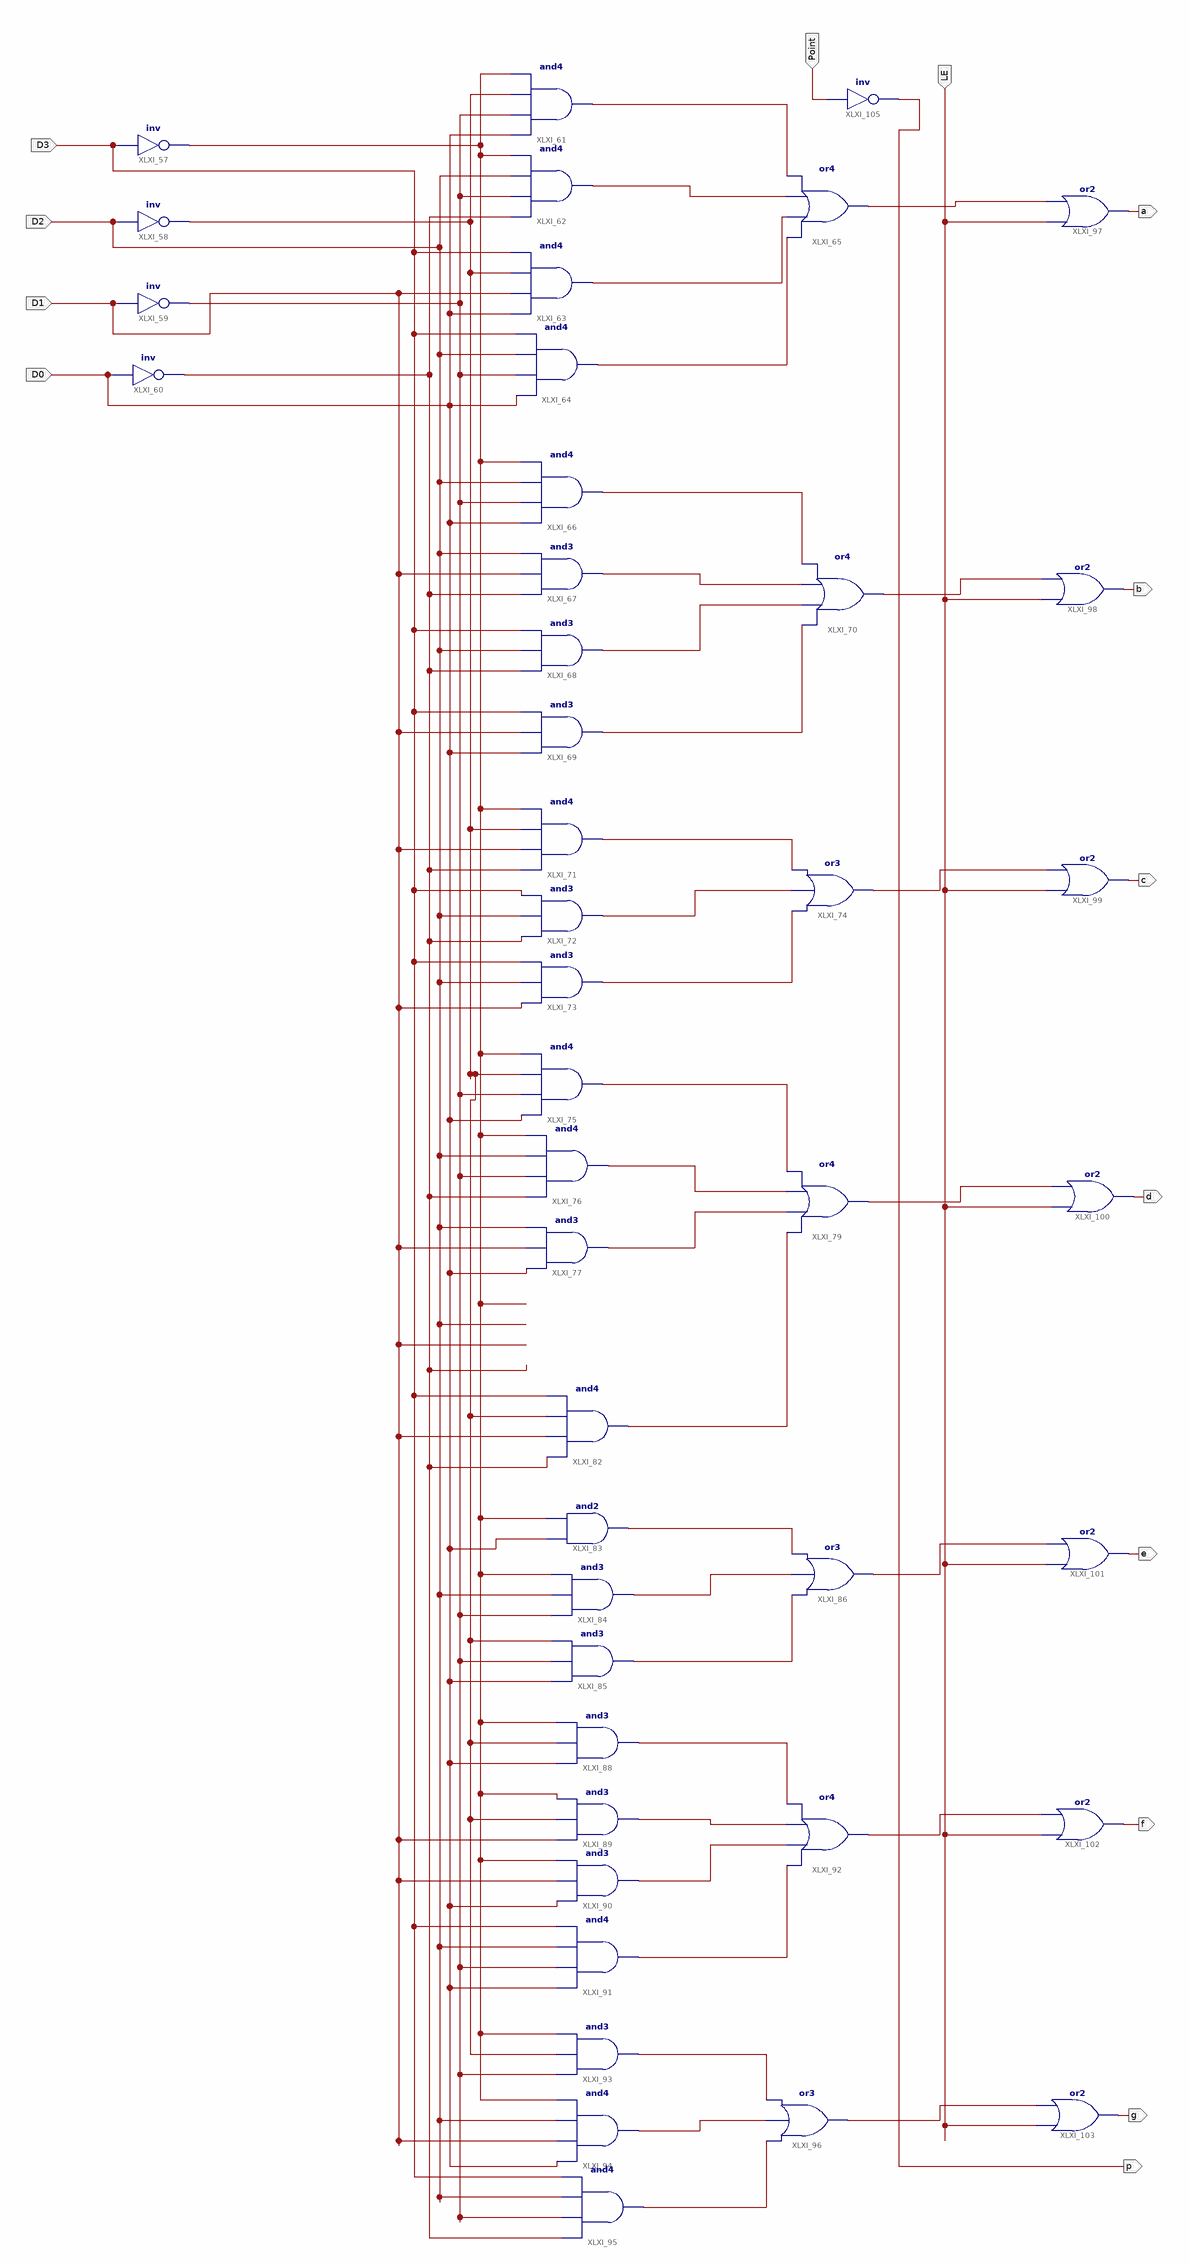
[diagram p0: schematic sheet 1]
// Xilinx ISE schematic MC14495.sch (kintex7) as structural Verilog: 44 symbols, 14 ports
module MC14495 (
  input  D2,
  input  D3,
  input  D1,
  input  D0,
  input  LE,
  input  Point,
  output a,
  output b,
  output c,
  output d,
  output e,
  output f,
  output g,
  output p
);

  wire XLXN_48, XLXN_50, XLXN_58, XLXN_59, XLXN_60, XLXN_61, XLXN_95, XLXN_96, XLXN_97, XLXN_98, XLXN_104,
       XLXN_105, XLXN_106, XLXN_112, XLXN_113, XLXN_114, XLXN_117, XLXN_118, XLXN_119, XLXN_121, XLXN_122,
       XLXN_123, XLXN_125, XLXN_126, XLXN_127, XLXN_128, XLXN_130, XLXN_132, XLXN_133, XLXN_136, XLXN_137,
       XLXN_138, XLXN_139, XLXN_140, XLXN_141, XLXN_142;

  not XLXI_57 (XLXN_123, D3);
  not XLXI_58 (XLXN_48, D2);
  not XLXI_59 (XLXN_50, D1);
  not XLXI_60 (XLXN_117, D0);
  and XLXI_61 (XLXN_58, D0, XLXN_50, XLXN_48, XLXN_123);
  and XLXI_62 (XLXN_59, XLXN_117, XLXN_50, D2, XLXN_123);
  and XLXI_63 (XLXN_60, D0, D1, XLXN_48, D3);
  and XLXI_64 (XLXN_61, D0, XLXN_50, D2, D3);
  or XLXI_65 (XLXN_142, XLXN_61, XLXN_60, XLXN_59, XLXN_58);
  and XLXI_66 (XLXN_95, D0, XLXN_50, D2, XLXN_123);
  and XLXI_67 (XLXN_96, XLXN_117, D1, D2);
  and XLXI_68 (XLXN_97, XLXN_117, D2, D3);
  and XLXI_69 (XLXN_98, D0, D1, D3);
  or XLXI_70 (XLXN_141, XLXN_98, XLXN_97, XLXN_96, XLXN_95);
  and XLXI_71 (XLXN_104, XLXN_117, D1, XLXN_48, XLXN_123);
  and XLXI_72 (XLXN_105, XLXN_117, D2, D3);
  and XLXI_73 (XLXN_106, D1, D2, D3);
  or XLXI_74 (XLXN_140, XLXN_106, XLXN_105, XLXN_104);
  and XLXI_76 (XLXN_113, XLXN_117, XLXN_50, D2, XLXN_123);
  and XLXI_77 (XLXN_114, D0, D1, D2);
  or XLXI_79 (XLXN_139, XLXN_118, XLXN_114, XLXN_113, XLXN_112);
  and XLXI_75 (XLXN_112, D0, XLXN_50, XLXN_48, XLXN_123);
  and XLXI_82 (XLXN_118, XLXN_117, D1, XLXN_48, D3);
  and XLXI_83 (XLXN_119, D0, XLXN_123);
  and XLXI_84 (XLXN_121, XLXN_50, D2, XLXN_123);
  and XLXI_85 (XLXN_122, D0, XLXN_50, XLXN_48);
  or XLXI_86 (XLXN_138, XLXN_122, XLXN_121, XLXN_119);
  and XLXI_88 (XLXN_125, D0, XLXN_48, XLXN_123);
  and XLXI_89 (XLXN_126, D1, XLXN_48, XLXN_123);
  and XLXI_90 (XLXN_127, D0, D1, XLXN_123);
  and XLXI_91 (XLXN_128, D0, XLXN_50, D2, D3);
  or XLXI_92 (XLXN_137, XLXN_128, XLXN_127, XLXN_126, XLXN_125);
  and XLXI_93 (XLXN_130, XLXN_50, XLXN_48, XLXN_123);
  and XLXI_94 (XLXN_132, D0, D1, D2, XLXN_123);
  and XLXI_95 (XLXN_133, XLXN_117, XLXN_50, D2, D3);
  or XLXI_96 (XLXN_136, XLXN_133, XLXN_132, XLXN_130);
  or XLXI_97 (a, LE, XLXN_142);
  or XLXI_98 (b, LE, XLXN_141);
  or XLXI_99 (c, LE, XLXN_140);
  or XLXI_100 (d, LE, XLXN_139);
  or XLXI_101 (e, LE, XLXN_138);
  or XLXI_102 (f, LE, XLXN_137);
  or XLXI_103 (g, LE, XLXN_136);
  not XLXI_105 (p, Point);
endmodule
